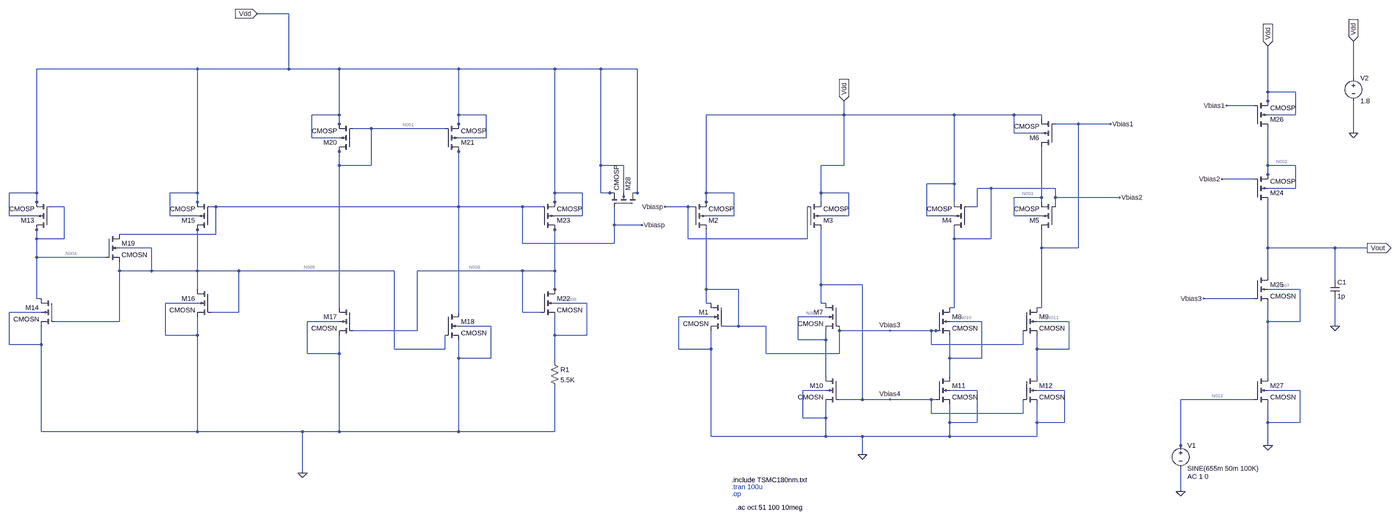
[diagram p0: schematic 180nm.asc, whole sheet]
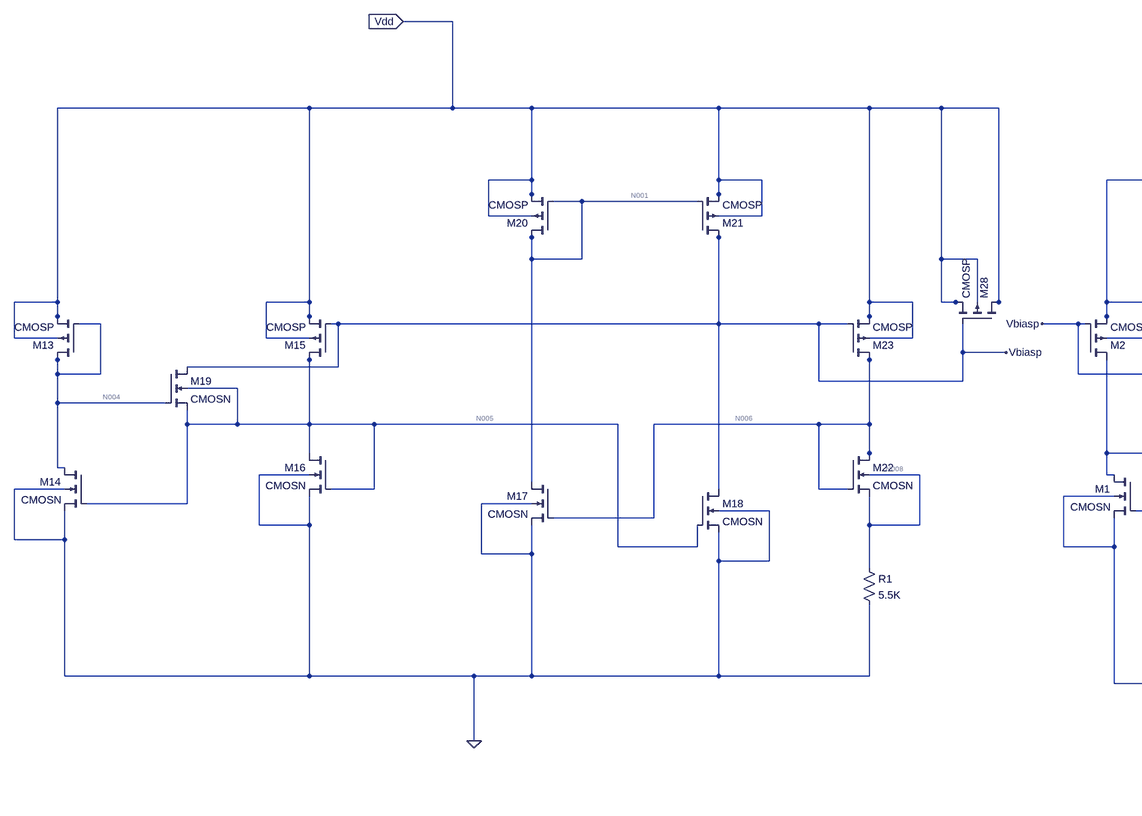
[diagram p1: schematic 180nm.asc, part, row 1 of 1, column 1 of 2]
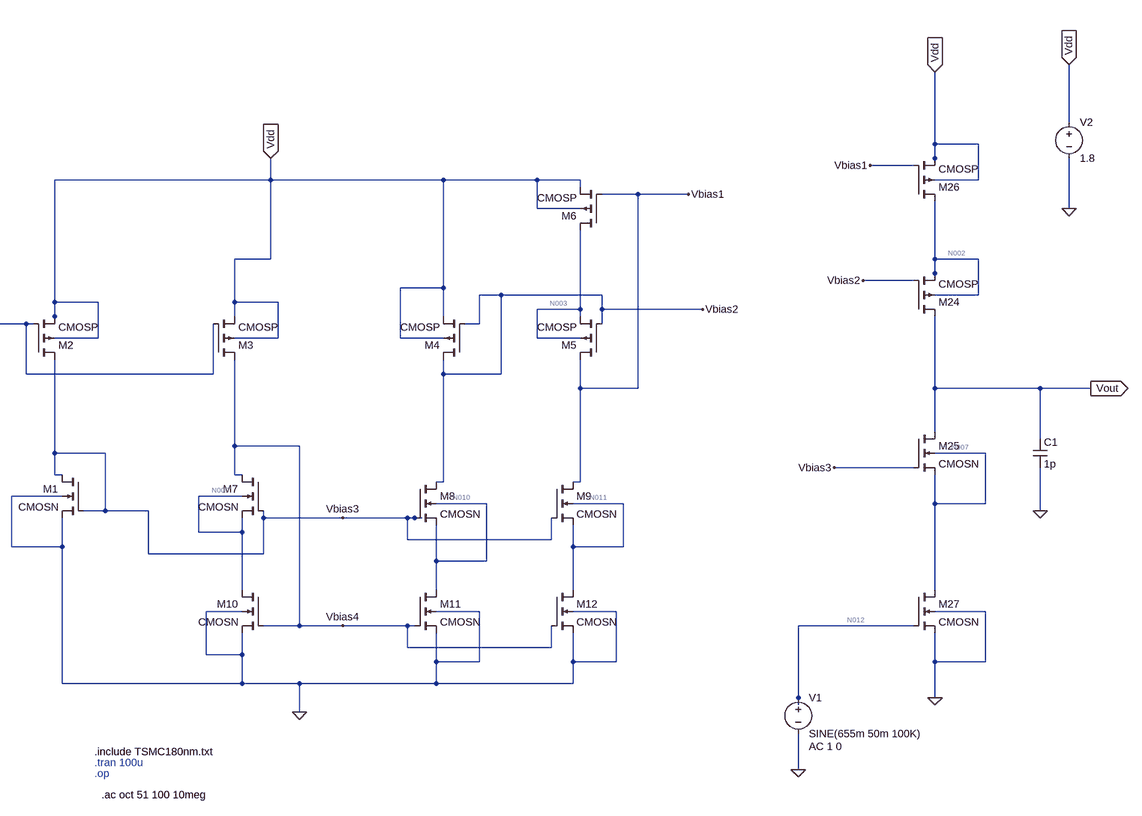
[diagram p2: schematic 180nm.asc, part, row 1 of 1, column 2 of 2]
180nm.asc, the LTspice schematic file:
Version 4
SHEET 1 3896 1288
WIRE -1008 -448 -1168 -448
WIRE -1376 -256 -1936 -256
WIRE -1008 -256 -1008 -448
WIRE -1008 -256 -1376 -256
WIRE -832 -256 -1008 -256
WIRE -416 -256 -832 -256
WIRE -48 -256 -416 -256
WIRE 112 -256 -48 -256
WIRE 240 -256 112 -256
WIRE 3088 -224 3088 -352
WIRE 2640 -176 2640 -336
WIRE 2736 -176 2640 -176
WIRE 2640 -144 2640 -176
WIRE 2592 -128 2496 -128
WIRE 2640 -128 2640 -144
WIRE -832 -96 -832 -256
WIRE -832 -96 -928 -96
WIRE -416 -96 -416 -256
WIRE -320 -96 -416 -96
WIRE 960 -96 960 -144
WIRE 960 -96 480 -96
WIRE 1344 -96 960 -96
WIRE 1552 -96 1344 -96
WIRE 1648 -96 1552 -96
WIRE 2736 -96 2736 -176
WIRE 2736 -96 2640 -96
WIRE 1648 -80 1648 -96
WIRE -832 -64 -832 -96
WIRE -416 -64 -416 -96
WIRE 1776 -64 1696 -64
WIRE 1920 -64 1776 -64
WIRE -832 -48 -832 -64
WIRE -720 -48 -784 -48
WIRE -464 -48 -720 -48
WIRE -416 -48 -416 -64
WIRE 1552 -32 1552 -96
WIRE 1648 -32 1552 -32
WIRE 3088 -32 3088 -144
WIRE -928 -16 -928 -96
WIRE -832 -16 -928 -16
WIRE -320 -16 -320 -96
WIRE -320 -16 -416 -16
WIRE -832 32 -832 16
WIRE -416 32 -416 16
WIRE -832 80 -832 32
WIRE -720 80 -720 -48
WIRE -720 80 -832 80
WIRE 112 80 112 -256
WIRE 192 80 112 80
WIRE 960 80 960 -96
WIRE 960 80 880 80
WIRE 2640 80 2640 -48
WIRE 2736 80 2640 80
WIRE 2640 112 2640 80
WIRE 2592 128 2480 128
WIRE 2640 128 2640 112
WIRE 1344 144 1344 -96
WIRE 1344 144 1248 144
WIRE 1472 160 1424 160
WIRE 1696 160 1472 160
WIRE 2736 160 2736 80
WIRE 2736 160 2640 160
WIRE -1936 176 -1936 -256
WIRE -1936 176 -2032 176
WIRE -1376 176 -1376 -256
WIRE -1376 176 -1472 176
WIRE -48 176 -48 -256
WIRE 48 176 -48 176
WIRE 112 176 112 80
WIRE 144 176 112 176
WIRE 160 176 144 176
WIRE 192 176 192 80
WIRE 240 176 240 -256
WIRE 240 176 224 176
WIRE 480 176 480 -96
WIRE 576 176 480 176
WIRE 880 176 880 80
WIRE 976 176 880 176
WIRE 1648 192 1648 16
WIRE 1648 192 1552 192
WIRE 1696 192 1696 160
WIRE 1952 192 1696 192
WIRE -1936 208 -1936 176
WIRE -1376 208 -1376 176
WIRE -48 208 -48 176
WIRE 480 208 480 176
WIRE 880 208 880 176
WIRE 1344 208 1344 144
WIRE 1648 208 1648 192
WIRE -1936 224 -1936 208
WIRE -1840 224 -1888 224
WIRE -1376 224 -1376 208
WIRE -1312 224 -1328 224
WIRE -416 224 -416 32
WIRE -416 224 -1312 224
WIRE -160 224 -416 224
WIRE -96 224 -160 224
WIRE -48 224 -48 208
WIRE 416 224 336 224
WIRE 432 224 416 224
WIRE 480 224 480 208
WIRE 1424 224 1424 160
WIRE 1424 224 1392 224
WIRE 1696 224 1696 192
WIRE -2032 256 -2032 176
WIRE -1936 256 -2032 256
WIRE -1472 256 -1472 176
WIRE -1376 256 -1472 256
WIRE 48 256 48 176
WIRE 48 256 -48 256
WIRE 576 256 576 176
WIRE 576 256 480 256
WIRE 976 256 976 176
WIRE 976 256 880 256
WIRE 1248 256 1248 144
WIRE 1344 256 1248 256
WIRE 1552 256 1552 192
WIRE 1648 256 1552 256
WIRE 160 288 160 224
WIRE 256 288 160 288
WIRE -1936 304 -1936 288
WIRE -1376 304 -1376 288
WIRE -48 304 -48 288
WIRE -1312 320 -1312 224
WIRE -1312 320 -1648 320
WIRE -1936 336 -1936 304
WIRE -1840 336 -1840 224
WIRE -1840 336 -1936 336
WIRE 416 336 416 224
WIRE 832 336 832 224
WIRE 832 336 416 336
WIRE 1344 336 1344 304
WIRE 1472 336 1472 160
WIRE 1472 336 1344 336
WIRE -160 352 -160 224
WIRE 160 352 160 288
WIRE 160 352 -160 352
WIRE -1536 368 -1648 368
WIRE 1648 368 1648 304
WIRE 1776 368 1776 -64
WIRE 1776 368 1648 368
WIRE 2640 368 2640 208
WIRE 3024 368 2640 368
WIRE 3136 368 3024 368
WIRE -1936 400 -1936 336
WIRE -1696 400 -1936 400
WIRE -1648 448 -1648 416
WIRE -1536 448 -1536 368
WIRE -1536 448 -1648 448
WIRE -1376 448 -1376 304
WIRE -1376 448 -1536 448
WIRE -1232 448 -1376 448
WIRE -640 448 -1232 448
WIRE -160 448 -560 448
WIRE -48 448 -48 304
WIRE -48 448 -160 448
WIRE 2640 464 2640 368
WIRE 3024 480 3024 368
WIRE 880 496 880 304
WIRE 1024 496 880 496
WIRE -1376 512 -1376 448
WIRE -48 512 -48 448
WIRE 480 512 480 304
WIRE 592 512 480 512
WIRE 2752 512 2640 512
WIRE -48 528 -48 512
WIRE -1936 544 -1936 400
WIRE -1920 544 -1936 544
WIRE 2592 544 2416 544
WIRE -1376 560 -1488 560
WIRE 64 560 -48 560
WIRE 480 560 480 512
WIRE 496 560 480 560
WIRE 880 560 880 496
WIRE 896 560 880 560
WIRE -832 576 -832 80
WIRE 1344 576 1344 336
WIRE 1344 576 1328 576
WIRE 1648 576 1648 368
WIRE 1648 576 1632 576
WIRE -1920 592 -2032 592
WIRE -1232 592 -1232 448
WIRE -1232 592 -1328 592
WIRE -416 592 -416 224
WIRE -160 592 -160 448
WIRE -96 592 -160 592
WIRE 496 608 384 608
WIRE 896 608 800 608
WIRE -1648 624 -1648 448
WIRE -1648 624 -1872 624
WIRE -832 624 -944 624
WIRE 1440 624 1328 624
WIRE 1744 624 1632 624
WIRE 2640 624 2640 560
WIRE 2752 624 2752 512
WIRE 2752 624 2640 624
WIRE -304 640 -416 640
WIRE 592 640 592 512
WIRE 592 640 544 640
WIRE 688 640 592 640
WIRE 3024 640 3024 544
WIRE -560 656 -560 448
WIRE -560 656 -784 656
WIRE 944 656 944 640
WIRE 1120 656 944 656
WIRE 1264 656 1120 656
WIRE 1280 656 1264 656
WIRE 1296 656 1280 656
WIRE -1488 672 -1488 560
WIRE -1376 672 -1376 608
WIRE -1376 672 -1488 672
WIRE -48 672 -48 608
WIRE 64 672 64 560
WIRE 64 672 -48 672
WIRE 800 688 800 608
WIRE 896 688 896 656
WIRE 896 688 800 688
WIRE -2032 704 -2032 592
WIRE -1920 704 -1920 640
WIRE -1920 704 -2032 704
WIRE 1264 704 1264 656
WIRE 1584 704 1584 656
WIRE 1584 704 1264 704
WIRE -640 720 -640 448
WIRE -464 720 -464 672
WIRE -464 720 -640 720
WIRE 384 720 384 608
WIRE 496 720 496 656
WIRE 496 720 384 720
WIRE 1632 720 1632 672
WIRE 1744 720 1744 624
WIRE 1744 720 1632 720
WIRE -944 736 -944 624
WIRE -832 736 -832 672
WIRE -832 736 -944 736
WIRE 688 736 688 640
WIRE 944 736 944 656
WIRE 944 736 688 736
WIRE -416 752 -416 688
WIRE -304 752 -304 640
WIRE -304 752 -416 752
WIRE 1328 752 1328 672
WIRE 1440 752 1440 624
WIRE 1440 752 1328 752
WIRE -48 768 -48 672
WIRE 896 816 896 688
WIRE 1328 816 1328 752
WIRE 1632 816 1632 720
WIRE 2640 816 2640 624
WIRE 896 864 816 864
WIRE 1424 864 1328 864
WIRE 1728 864 1632 864
WIRE 2752 864 2640 864
WIRE 1024 896 1024 496
WIRE 1024 896 944 896
WIRE 1120 896 1024 896
WIRE 1264 896 1120 896
WIRE 1280 896 1264 896
WIRE 2592 896 2336 896
WIRE 1264 944 1264 896
WIRE 1584 944 1584 896
WIRE 1584 944 1264 944
WIRE 816 960 816 864
WIRE 896 960 896 912
WIRE 896 960 816 960
WIRE 1328 976 1328 912
WIRE 1424 976 1424 864
WIRE 1424 976 1328 976
WIRE 1632 976 1632 912
WIRE 1728 976 1728 864
WIRE 1728 976 1632 976
WIRE 2640 976 2640 912
WIRE 2752 976 2752 864
WIRE 2752 976 2640 976
WIRE -1920 1008 -1920 704
WIRE -1376 1008 -1376 672
WIRE -1376 1008 -1920 1008
WIRE -960 1008 -1376 1008
WIRE -832 1008 -832 736
WIRE -832 1008 -960 1008
WIRE -416 1008 -416 752
WIRE -416 1008 -832 1008
WIRE -48 1008 -48 848
WIRE -48 1008 -416 1008
WIRE 496 1024 496 720
WIRE 896 1024 896 960
WIRE 896 1024 496 1024
WIRE 1024 1024 896 1024
WIRE 1328 1024 1328 976
WIRE 1328 1024 1024 1024
WIRE 1632 1024 1632 976
WIRE 1632 1024 1328 1024
WIRE 2336 1056 2336 896
WIRE 2640 1056 2640 976
WIRE 2336 1072 2336 1056
WIRE 1024 1088 1024 1024
WIRE -960 1152 -960 1008
WIRE 2336 1216 2336 1136
FLAG 1024 1088 0
FLAG 960 -144 Vdd
IOPIN 960 -144 In
FLAG -960 1152 0
FLAG -1168 -448 Vdd
IOPIN -1168 -448 In
FLAG 2336 1216 0
FLAG 3024 640 0
FLAG 1920 -64 Vbias1
FLAG 1952 192 Vbias2
FLAG 336 224 Vbiasp
FLAG 1120 656 Vbias3
FLAG 1120 896 Vbias4
FLAG 2496 -128 Vbias1
FLAG 2480 128 Vbias2
FLAG 2416 544 Vbias3
FLAG 2640 -336 Vdd
IOPIN 2640 -336 In
FLAG 3088 -32 0
FLAG 3088 -352 Vdd
IOPIN 3088 -352 In
FLAG 3136 368 Vout
IOPIN 3136 368 Out
FLAG 256 288 Vbiasp
FLAG 2640 1056 0
SYMBOL pmos4 432 304 M180
SYMATTR InstName M2
SYMATTR Value CMOSP
SYMATTR Value2 l=0.36u w=4.32u
SYMBOL nmos4 544 560 M0
SYMATTR InstName M1
SYMATTR Value CMOSN
SYMATTR Value2 l=0.36u w=0.9u
SYMBOL pmos4 832 304 M180
SYMATTR InstName M3
SYMATTR Value CMOSP
SYMATTR Value2 l=0.36u w=4.32u
SYMBOL pmos4 1392 304 R180
SYMATTR InstName M4
SYMATTR Value CMOSP
SYMATTR Value2 l=0.9u w=3.6u
SYMBOL pmos4 1696 304 R180
SYMATTR InstName M5
SYMATTR Value CMOSP
SYMATTR Value2 l=0.36u w=4.32u
SYMBOL pmos4 1696 16 R180
SYMATTR InstName M6
SYMATTR Value CMOSP
SYMATTR Value2 l=0.36u w=4.32u
SYMBOL nmos4 944 560 M0
SYMATTR InstName M7
SYMATTR Value CMOSN
SYMATTR Value2 l=0.36u w=1.8u
SYMBOL nmos4 1280 576 R0
SYMATTR InstName M8
SYMATTR Value CMOSN
SYMATTR Value2 l=0.36u w=1.8u
SYMBOL nmos4 1584 576 R0
SYMATTR InstName M9
SYMATTR Value CMOSN
SYMATTR Value2 l=0.36u w=1.8u
SYMBOL nmos4 944 816 M0
SYMATTR InstName M10
SYMATTR Value CMOSN
SYMATTR Value2 l=0.36u w=1.8u
SYMBOL nmos4 1280 816 R0
SYMATTR InstName M11
SYMATTR Value CMOSN
SYMATTR Value2 l=0.36u w=1.8u
SYMBOL nmos4 1584 816 R0
SYMATTR InstName M12
SYMATTR Value CMOSN
SYMATTR Value2 l=0.36u w=1.8u
SYMBOL pmos4 -1888 304 R180
SYMATTR InstName M13
SYMATTR Value CMOSP
SYMATTR Value2 l=3.6u w=1.8u
SYMBOL nmos4 -1872 544 M0
SYMATTR InstName M14
SYMATTR Value CMOSN
SYMATTR Value2 l=0.36u w=1.8u
SYMBOL pmos4 -1328 304 R180
SYMATTR InstName M15
SYMATTR Value CMOSP
SYMATTR Value2 l=0.36u w=4.32u
SYMBOL nmos4 -1328 512 M0
SYMATTR InstName M16
SYMATTR Value CMOSN
SYMATTR Value2 l=0.36u w=1.8u
SYMBOL nmos4 -784 576 M0
SYMATTR InstName M17
SYMATTR Value CMOSN
SYMATTR Value2 l=0.36u w=1.8u
SYMBOL nmos4 -464 592 R0
SYMATTR InstName M18
SYMATTR Value CMOSN
SYMATTR Value2 l=0.36u w=1.8u
SYMBOL nmos4 -1696 320 R0
SYMATTR InstName M19
SYMATTR Value CMOSN
SYMATTR Value2 l=0.36u w=0.72u
SYMBOL pmos4 -784 32 R180
SYMATTR InstName M20
SYMATTR Value CMOSP
SYMATTR Value2 l=0.36u w=4.32u
SYMBOL pmos4 -464 32 M180
SYMATTR InstName M21
SYMATTR Value CMOSP
SYMATTR Value2 l=0.36u w=4.32u
SYMBOL nmos4 -96 512 R0
SYMATTR InstName M22
SYMATTR Value CMOSN
SYMATTR Value2 l=0.36u w=5.4u
SYMBOL res -64 752 R0
SYMATTR InstName R1
SYMATTR Value 5.5K
SYMBOL pmos4 -96 304 M180
SYMATTR InstName M23
SYMATTR Value CMOSP
SYMATTR Value2 l=0.36u w=4.32u
SYMBOL pmos4 2592 208 M180
SYMATTR InstName M24
SYMATTR Value CMOSP
SYMATTR Value2 l=180n w=2340n
SYMBOL nmos4 2592 464 R0
SYMATTR InstName M25
SYMATTR Value CMOSN
SYMATTR Value2 l=180n w=468n
SYMBOL pmos4 2592 -48 M180
SYMATTR InstName M26
SYMATTR Value CMOSP
SYMATTR Value2 l=180n w=2340n
SYMBOL nmos4 2592 816 R0
SYMATTR InstName M27
SYMATTR Value CMOSN
SYMATTR Value2 l=180n w=468n
SYMBOL cap 3008 480 R0
SYMATTR InstName C1
SYMATTR Value 1p
SYMBOL voltage 2336 1040 R0
WINDOW 123 24 124 Left 2
WINDOW 39 0 0 Left 0
SYMATTR Value2 AC 1 0
SYMATTR InstName V1
SYMATTR Value SINE(655m 50m 100K)
SYMBOL pmos4 240 224 M270
SYMATTR InstName M28
SYMATTR Value CMOSP
SYMATTR Value2 l=9u w=9u
SYMBOL voltage 3088 -240 R0
WINDOW 123 0 0 Left 0
WINDOW 39 0 0 Left 0
SYMATTR InstName V2
SYMATTR Value 1.8
TEXT 568 1176 Left 2 !.include TSMC180nm.txt
TEXT 568 1200 Left 2 ;.tran 100u
TEXT 568 1224 Left 2 ;.op
TEXT 584 1272 Left 2 !.ac oct 51 100 10meg

The netlist it stands for:
* 180nm.asc
M2 Vbias3 Vbiasp Vdd Vdd CMOSP l=0.36u w=4.32u
M1 Vbias3 Vbias3 0 0 CMOSN l=0.36u w=0.9u
M3 Vbias4 Vbiasp Vdd Vdd CMOSP l=0.36u w=4.32u
M4 Vbias2 Vbias2 Vdd Vdd CMOSP l=0.9u w=3.6u
M5 Vbias1 Vbias2 N003 N003 CMOSP l=0.36u w=4.32u
M6 N003 Vbias1 Vdd Vdd CMOSP l=0.36u w=4.32u
M7 Vbias4 Vbias3 N009 N009 CMOSN l=0.36u w=1.8u
M8 Vbias2 Vbias3 N010 N010 CMOSN l=0.36u w=1.8u
M9 Vbias1 Vbias3 N011 N011 CMOSN l=0.36u w=1.8u
M10 N009 Vbias4 0 0 CMOSN l=0.36u w=1.8u
M11 N010 Vbias4 0 0 CMOSN l=0.36u w=1.8u
M12 N011 Vbias4 0 0 CMOSN l=0.36u w=1.8u
M13 N004 N004 Vdd Vdd CMOSP l=3.6u w=1.8u
M14 N004 N005 0 0 CMOSN l=0.36u w=1.8u
M15 N005 Vbiasp Vdd Vdd CMOSP l=0.36u w=4.32u
M16 N005 N005 0 0 CMOSN l=0.36u w=1.8u
M17 N001 N006 0 0 CMOSN l=0.36u w=1.8u
M18 Vbiasp N005 0 0 CMOSN l=0.36u w=1.8u
M19 Vbiasp N004 N005 N005 CMOSN l=0.36u w=0.72u
M20 N001 N001 Vdd Vdd CMOSP l=0.36u w=4.32u
M21 Vbiasp N001 Vdd Vdd CMOSP l=0.36u w=4.32u
M22 N006 N006 N008 N008 CMOSN l=0.36u w=5.4u
R1 N008 0 5.5K
M23 N006 Vbiasp Vdd Vdd CMOSP l=0.36u w=4.32u
M24 Vout Vbias2 N002 N002 CMOSP l=180n w=2340n
M25 Vout Vbias3 N007 N007 CMOSN l=180n w=468n
M26 N002 Vbias1 Vdd Vdd CMOSP l=180n w=2340n
M27 N007 N012 0 0 CMOSN l=180n w=468n
C1 Vout 0 1p
V1 N012 0 SINE(655m 50m 100K) AC 1 0
M28 Vdd Vbiasp Vdd Vdd CMOSP l=9u w=9u
V2 Vdd 0 1.8
.model NMOS NMOS
.model PMOS PMOS
.lib standard.mos
.include TSMC180nm.txt
* .tran 100u
* .op
.ac oct 51 100 10meg
.backanno
.end

* Results of the author's LTspice run, read from the files saved beside the schematic
* Operating Point, zero values left out:
*   V(vbias3) = 629 mV
*   V(vbiasp) = 1.197 V
*   V(vdd) = 1.8 V
*   V(vbias4) = 652.4 mV
*   V(vbias2) = 1.066 V
*   V(vbias1) = 1.166 V
*   V(n003) = 1.679 V
*   V(n009) = 48.7 mV
*   V(n010) = 50.76 mV
*   V(n011) = 51.23 mV
*   V(n004) = 443.6 mV
*   V(n005) = 581.1 mV
*   V(n001) = 1.183 V
*   V(n006) = 581.4 mV
*   V(n008) = 61.29 mV
*   V(vout) = 1.272 V
*   V(n002) = 1.681 V
*   V(n007) = 64.58 mV
*   V(n012) = 655 mV
*   Id(M2) = -11.09 µA
*   Ib(M2) = 1.181 pA
*   Is(M2) = 11.09 µA
*   Id(M3) = -11.07 µA
*   Ib(M3) = 1.158 pA
*   Is(M3) = 11.07 µA
*   Id(M4) = -11.44 µA
*   Is(M4) = 11.44 µA
*   Id(M5) = -11.53 µA
*   Is(M5) = 11.53 µA
*   Id(M6) = -11.53 µA
*   Is(M6) = 11.53 µA
*   Id(M13) = -10.86 µA
*   Ib(M13) = 1.366 pA
*   Is(M13) = 10.86 µA
*   Id(M15) = -11.14 µA
*   Ib(M15) = 1.229 pA
*   Is(M15) = 11.14 µA
*   Id(M20) = -12.23 µA
*   Is(M20) = 12.23 µA
*   Id(M21) = -12.21 µA
*   Is(M21) = 12.21 µA
*   Id(M23) = -11.14 µA
*   Ib(M23) = 1.229 pA
*   Is(M23) = 11.14 µA
*   Id(M24) = -9.466 µA
*   Is(M24) = 9.466 µA
*   Id(M26) = -9.466 µA
*   Is(M26) = 9.466 µA
*   Id(M1) = 11.09 µA
*   Is(M1) = -11.09 µA
*   Id(M7) = 11.07 µA
*   Is(M7) = -11.07 µA
*   Id(M8) = 11.44 µA
*   Ib(M8) = -1.025 pA
*   Is(M8) = -11.44 µA
*   Id(M9) = 11.53 µA
*   Ib(M9) = -1.125 pA
*   Is(M9) = -11.53 µA
*   Id(M10) = 11.07 µA
*   Is(M10) = -11.07 µA
*   Id(M11) = 11.44 µA
*   Is(M11) = -11.44 µA
*   Id(M12) = 11.53 µA
*   Is(M12) = -11.53 µA
*   Id(M14) = 10.86 µA
*   Is(M14) = -10.86 µA
*   Id(M16) = 11.14 µA
*   Is(M16) = -11.14 µA
*   Id(M17) = 12.23 µA
*   Ib(M17) = -1.193 pA
*   Is(M17) = -12.23 µA
*   Id(M18) = 12.21 µA
*   Ib(M18) = -1.207 pA
*   Is(M18) = -12.21 µA
*   Id(M22) = 11.14 µA
*   Is(M22) = -11.14 µA
*   Id(M25) = 9.466 µA
*   Ib(M25) = -1.218 pA
*   Is(M25) = -9.466 µA
*   Id(M27) = 9.466 µA
*   Is(M27) = -9.466 µA
*   I(R1) = 11.14 µA
*   I(V2) = -112.2 µA
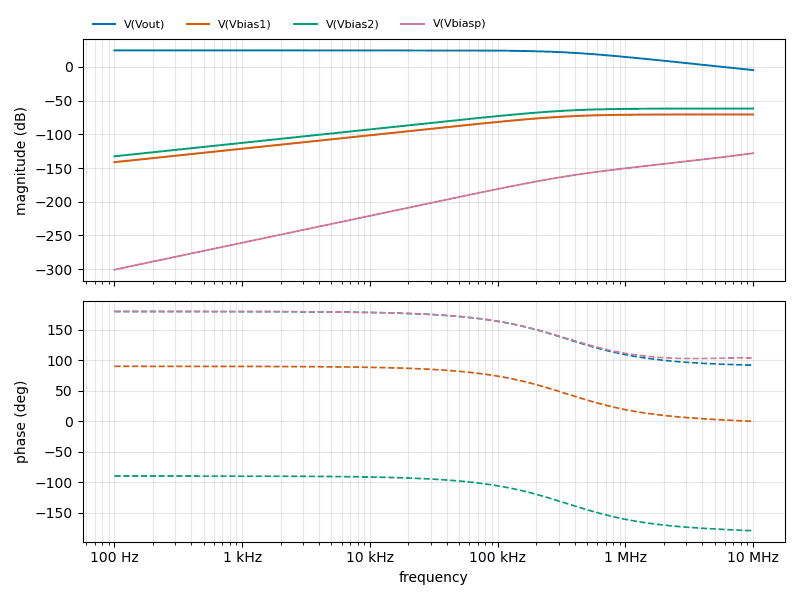
[diagram p3: AC Analysis of 180nm.asc, plotted from the saved traces]
* AC Analysis, 1 run:
*   V(Vout): 24.47 dB at 100 Hz, -4.72 dB at 10 MHz, peak 24.47 dB at 100 Hz, 3 dB below the peak at 347.3 kHz
*   V(Vbias1): -141.29 dB at 100 Hz, -70.60 dB at 10 MHz, peak -70.52 dB at 4.541 MHz, 3 dB below the peak at 343.3 kHz
*   V(Vbias2): -132.59 dB at 100 Hz, -61.70 dB at 10 MHz, peak -61.70 dB at 10 MHz, 3 dB below the peak at 353.4 kHz
*   V(Vbiasp): -300.76 dB at 100 Hz, -127.96 dB at 10 MHz, peak -127.96 dB at 10 MHz, 3 dB below the peak at 7.597 MHz